# EAGLE design H1DR1x-AT (EAGLE 9.6.0)
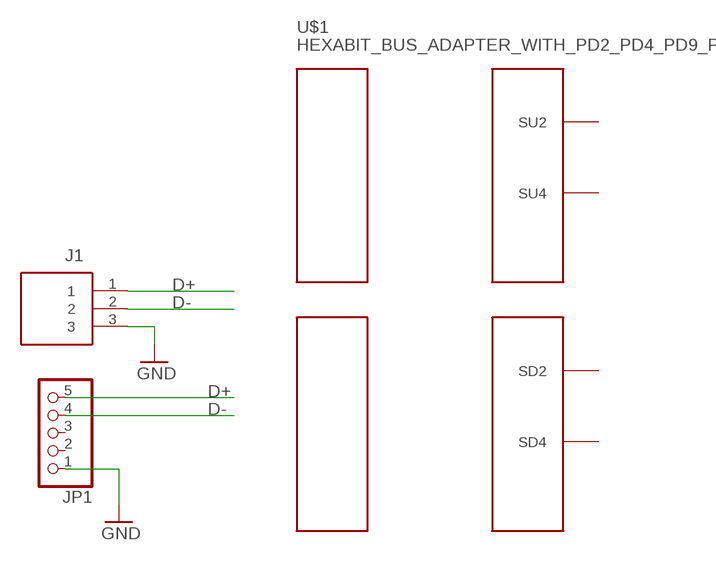
[diagram p0: schematic, sheet 1]

## Parts
J1  CON-PHOENIX-350_1755749  [SHDR3W100P0X508_1X3_1724X860X1]
JP1  PINHD-1X5  [F_1X05]
U$1  HEXABIT_BUS_ADAPTER_WITH_PD2_PD4_PD9_PD10  [HEXABIT_BUS_ADAPTER_WITH_P2_P4]

## Nets
D+: J1.1 JP1.5
D-: J1.2 JP1.4
GND: J1.3 JP1.1
Unconnected: JP1.2 JP1.3 U$1.PAD_PD2(SD2) U$1.PAD_PD4(SD4) U$1.PAD_PU2(SU2) U$1.PAD_PU4(SU4)

## Library data of the parts
J1 = Hexabitz:CON-PHOENIX-350_1755749: 3 way vertical PCB header,5.08mm pitch Phoenix Contact MSTBVA Series, 5.08mm Pitch 3 Way 1 Row Straight PCB Header, Solder Termination Source: Datasheet <https://componentsearchengine.com/Datasheets/1/1755749.pdf>; ALLIED_NUMBER: 70054652; ALLIED_PRICE-STOCK: https://www.alliedelec.com/phoenixcontact-1755749/70054652/; DESCRIPTION: 3 way vertical PCB header,5.08mm pitch Phoenix Contact MSTBVA Series, 5.08mm Pitch 3 Way 1 Row Straight PCB Header, Solder Termination; HEIGHT: 12mm; MANUFACTURER_NAME: Phoenix Contact; MANUFACTURER_PART_NUMBER: 1755749; MOUSER_PART_NUMBER: 651-1755749; MOUSER_PRICE-STOCK: https://www.mouser.com/Search/Refine.aspx?Keyword=651-1755749; RS_PART_NUMBER: 1896212; RS_PRICE-STOCK: https://uk.rs-online.com/web/p/products/1896212
JP1 = Hexabitz:PINHD-1X5: PIN HEADER Female right angle
U$1 = hexabitz_connectors:HEXABIT_BUS_ADAPTER_WITH_PD2_PD4_PD9_PD10

## Board
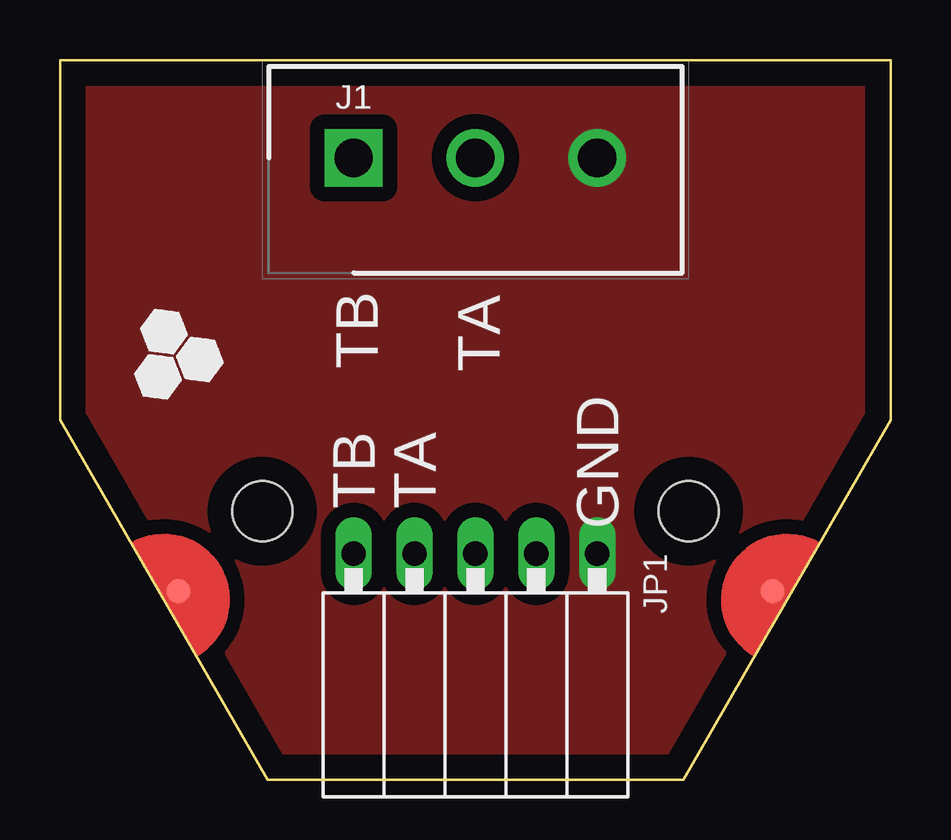
[diagram p1: board, top side]
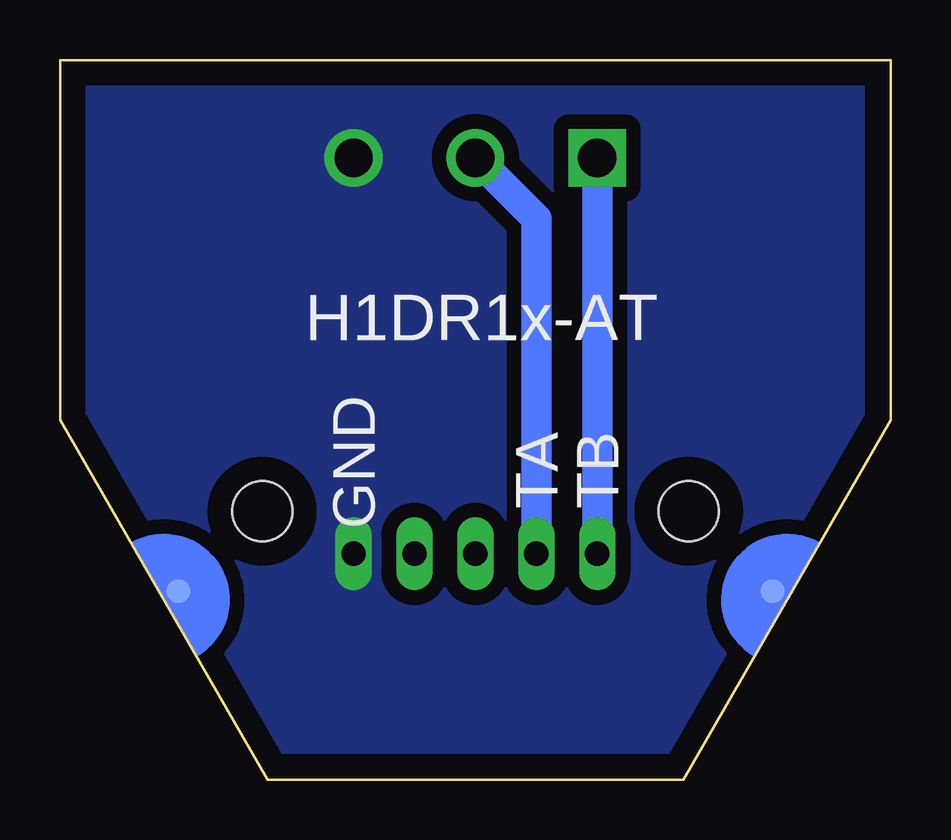
[diagram p2: board, bottom side, seen from below]

Size 34.64 x 30 mm. Coordinates in mm from the lower left corner, seen from the top.
Copper layers (1*16): Top 0.035mm / dielectric 0.15mm / Bottom 0.035mm
Design rules "default": minimum track width 6mil, minimum drill 0.35mm, track to track 6mil, track to pad 6mil, pad to pad 6mil, via to via 6mil, smd to smd 6mil, copper to edge 40mil, drill to drill 6mil, minimum pad ring 10mil, minimum via ring 8mil, stop-mask expansion 4mil, vias tented up to drill 0mil, thermal gap 10mil

### Footprints (pad centres in the part's own frame; a part is rotated, then mirrored left to right if it is on the bottom)
SHDR3W100P0X508_1X3_1724X860X1 = drill 1.6 pad 2.4 square: 1 0,0 | drill 1.6 pad 2.4: 2 5.08,0; 3 10.16,0
F_1X05 = drill 1.016 long: 1 -5.08,-2.54; 2 -2.54,-2.54; 3 0,-2.54; 4 2.54,-2.54; 5 5.08,-2.54
HEXABIT_BUS_ADAPTER_WITH_P2_P4 = smd 1 x 1 bottom: PAD_PD2 12.39,-7.15; PAD_PD4 -12.39,-7.15 | smd 1 x 1: PAD_PU2 12.39,-7.15; PAD_PU4 -12.39,-7.15 | hole 2.5: -8.89,-3.81; 8.89,-3.81

### Placement (x,y rotation side)
J1  12.24,25.92 0 top
JP1  17.32,6.87 180 top
U$1  17.32,15 0 top

### Tracks (layer width: path | path; a pad name or v marks a point on that pad's centre or on a via)
D+
  Bottom 1.27: JP1.5 J1.1
D-
  Bottom 1.27: JP1.4 14.78,23.38 J1.2
GND
  pour Bottom (isolate 0.61, no thermals): 34.59,29.99 0.05,29.99 0.05,0.01 34.59,0.01
  pour Top (isolate 0.61, no thermals): 0.05,29.99 34.72,29.99 34.72,-0.11 0.05,-0.11

### Text on the board
tPlace: TB | TA | GND | TB | TA
bPlace: H1DR1x-AT | GND | TB | TA